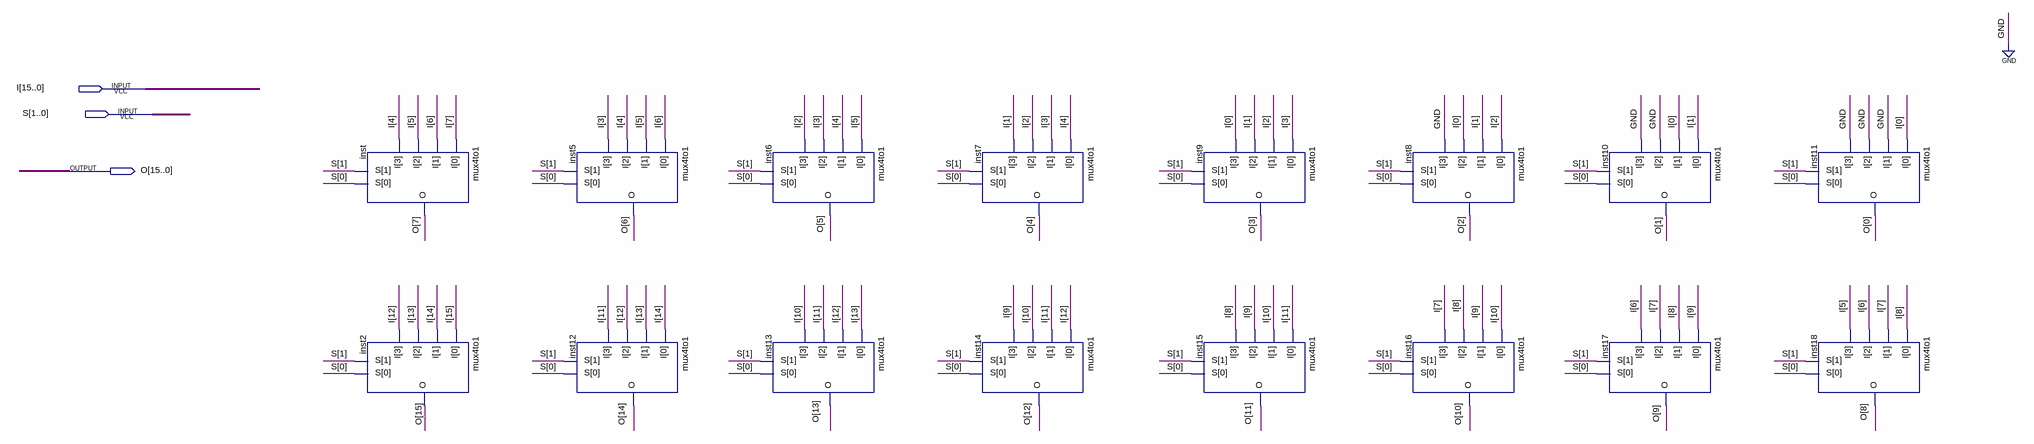
[diagram p0: schematic sheet]
// Quartus schematic Shifterleft.bdf as structural Verilog: 16 symbols, 3 pins
module Shifterleft (
  input  [15:0] I,
  input  [1:0] S,
  output [15:0] O
);

  mux4to1 inst (.S(S), .I({I[4], I[5], I[6], I[7]}), .O(O[7]));
  mux4to1 inst2 (.S(S), .I({I[12], I[13], I[14], I[15]}), .O(O[15]));
  mux4to1 inst5 (.S(S), .I({I[3], I[4], I[5], I[6]}), .O(O[6]));
  mux4to1 inst12 (.S(S), .I({I[11], I[12], I[13], I[14]}), .O(O[14]));
  mux4to1 inst6 (.S(S), .I({I[2], I[3], I[4], I[5]}), .O(O[5]));
  mux4to1 inst13 (.S(S), .I({I[10], I[11], I[12], I[13]}), .O(O[13]));
  mux4to1 inst7 (.S(S), .I({I[1], I[2], I[3], I[4]}), .O(O[4]));
  mux4to1 inst14 (.S(S), .I({I[9], I[10], I[11], I[12]}), .O(O[12]));
  mux4to1 inst9 (.S(S), .I({I[0], I[1], I[2], I[3]}), .O(O[3]));
  mux4to1 inst15 (.S(S), .I({I[8], I[9], I[10], I[11]}), .O(O[11]));
  mux4to1 inst8 (.S(S), .I({1'b0, I[0], I[1], I[2]}), .O(O[2]));
  mux4to1 inst16 (.S(S), .I({I[7], I[8], I[9], I[10]}), .O(O[10]));
  mux4to1 inst10 (.S(S), .I({2'b00, I[0], I[1]}), .O(O[1]));
  mux4to1 inst17 (.S(S), .I({I[6], I[7], I[8], I[9]}), .O(O[9]));
  mux4to1 inst11 (.S(S), .I({3'b000, I[0]}), .O(O[0]));
  mux4to1 inst18 (.S(S), .I({I[5], I[6], I[7], I[8]}), .O(O[8]));
endmodule
